# Altium schematic sheet gps.SchDoc
size A4; SheetNumber: 2; SheetTotal: 6
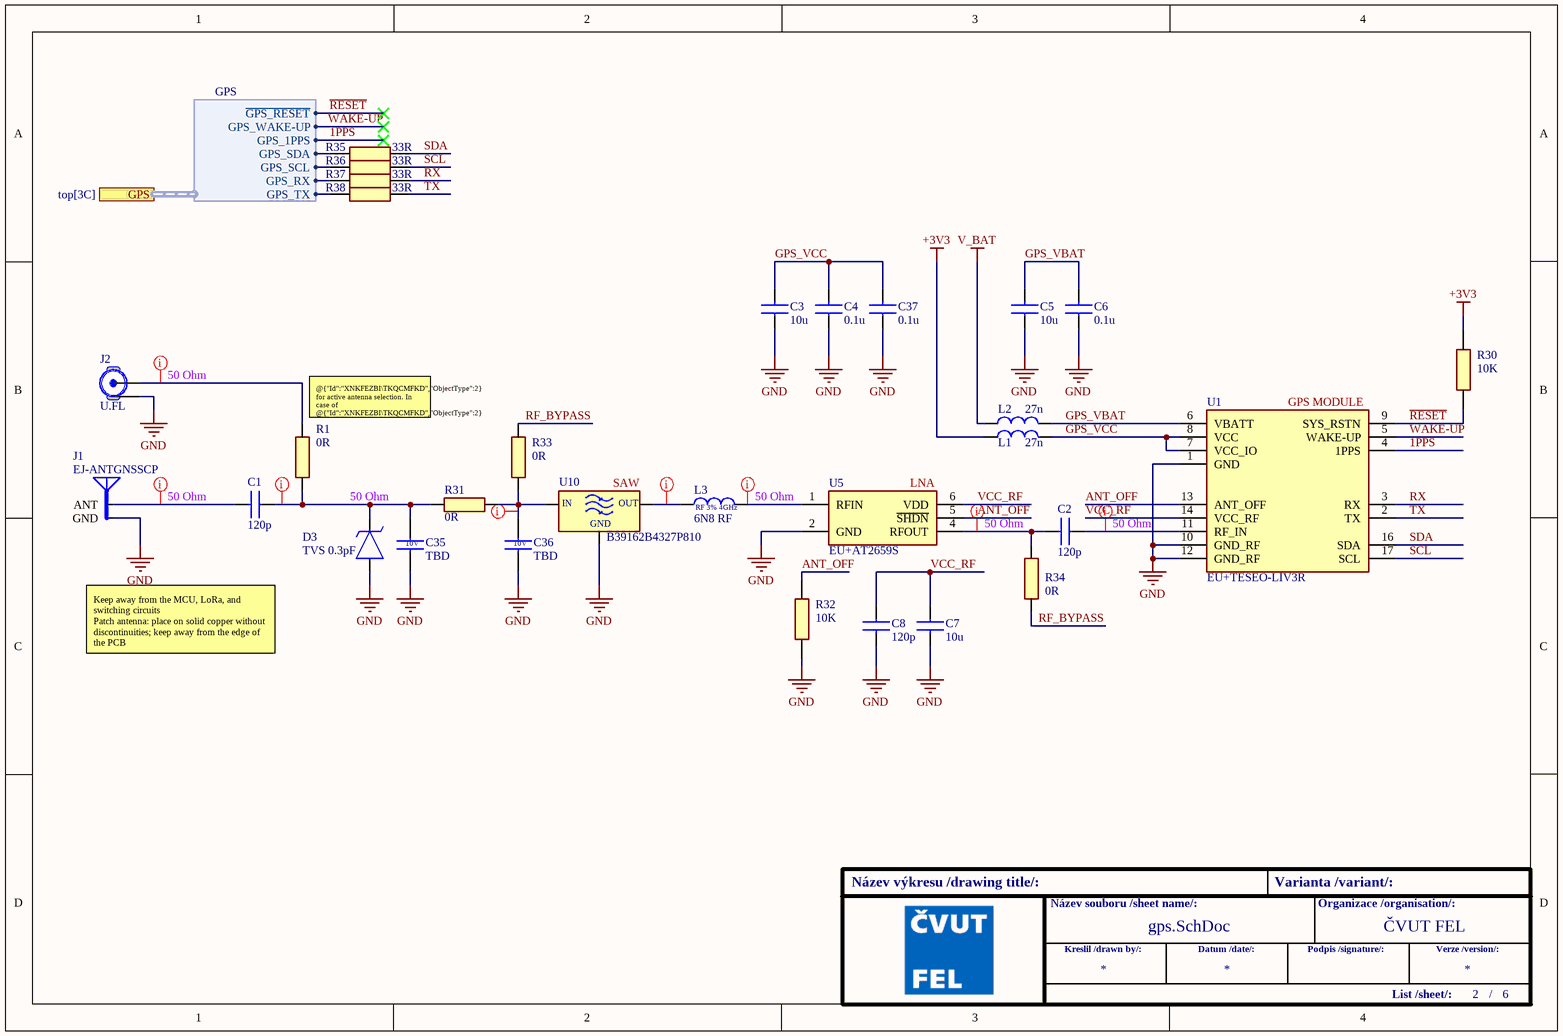
[diagram p0: gps.SchDoc]

## Parts
C1  120p  [CAPC1005X55N]
C2  120p  [CAPC1005X55N]
C3  10u  [C0603]
C4  0.1u  [CAPC1608X95N]
C5  10u  [C0603]
C6  0.1u  [CAPC1608X95N]
C7  10u  [C0603]
C8  120p  [CAPC1005X55N]
C35  TBD  [CAPC1608X97N]
C36  TBD  [CAPC1608X97N]
C37  0.1u  [CAPC1608X95N]
D3  TVS 0.3pF  [SP320501ETG]
J1  EJ-ANTGNSSCP  [ANTGNSSCPTH18L1]
J2  U.FL  [CONUFL001SMDT]
L1  27n  [LQG15WH0N7B02D]
L2  27n  [LQG15WH0N7B02D]
L3  6N8 RF  [LQW15CNR20J00B]
R1  0R  [RESC1005X37N]
R30  10K  [RESC1608X50N]
R31  0R  [RESC1005X37N]
R32  10K  [RESC1608X50N]
R33  0R  [RESC1005X37N]
R34  0R  [RESC1005X37N]
R35  33R  [RESC1608X55N]
R36  33R  [RESC1608X55N]
R37  33R  [RESC1608X55N]
R38  33R  [RESC1608X55N]
U1  EU+TESEO-LIV3R  [TESEOLIV3R]
U5  EU+AT2659S  [SOT95P280X125-6N]
U10  B39162B4327P810  [B39162B4327P810]

## Ports
GPS (harness GPS, see top[3C])

## Harnesses
GPS: GPS_TX, GPS_RX, GPS_SCL, GPS_SDA, GPS_1PPS, GPS_WAKE-UP, ~{GPS_RESET}

## Nets
+3V3: L1.23 R30.2
GND: C3.1 C4.1 C5.1 C6.1 C7.1 C8.1 C35.2 C36.2 C37.1 D3.2(A) J1.2(GND) J2.2(GND) R32.1 U1.1(GND) U1.10(GND_RF) U1.12(GND_RF) U5.2(GND) U10.2
V_BAT: L2.23
1PPS: U1.4(1PPS) ; port GPS.GPS_1PPS
ANT_OFF: R32.2 U1.13(ANT_OFF) U5.5(~{SHDN})
GPS_VBAT: C5.2 C6.2 L2.24 U1.6(VBATT)
GPS_VCC: C3.2 C4.2 C37.2 L1.24 U1.7(VCC_IO) U1.8(VCC)
~{RESET}: R30.1 U1.9(SYS_RSTN) ; port GPS.~{GPS_RESET}
RF_BYPASS: R33.2 R34.1
RX: R37.2 U1.3(RX)
SCL: R36.2 U1.17(SCL)
SDA: R35.2 U1.16(SDA)
TX: R38.2 U1.2(TX)
VCC_RF: C7.2 C8.2 U1.14(VCC_RF) U5.6(VDD)
WAKE-UP: U1.5(WAKE-UP) ; port GPS.GPS_WAKE-UP
NetC1_1: C1.1 J1.1(ANT)
NetC1_2: C1.2 C35.1 D3.1(K) R1.1 R31.1
NetC2_1: C2.1 R34.2 U5.4(RFOUT)
NetC2_2: C2.2 U1.11(RF_IN)
NetC36_1: C36.1 R31.2 R33.1 U10.1(IN)
NetJ2_1: J2.1(SIG) R1.2
NetL3_23: L3.23 U10.4(OUT)
NetL3_24: L3.24 U5.1(RFIN)
NetR35_1: R35.1 ; port GPS.GPS_SDA
NetR36_1: R36.1 ; port GPS.GPS_SCL
NetR37_1: R37.1 ; port GPS.GPS_RX
NetR38_1: R38.1 ; port GPS.GPS_TX

## Layout directives
net class 50R_RF: NetC1_1, NetC1_2, NetC2_1, NetC2_2, NetC36_1, NetJ2_1, NetL3_23, NetL3_24

## Notes on the sheet
- 50 Ohm
- (near R1) @{"Id":"XNKFEZBI\TKQCMFKD","ObjectType":2} for active antenna selection. In case of @{"Id":"XNKFEZBI\TKQCMFKD","ObjectType":2} placed leave @{"Id":"XNKFEZBI\TFZHEKEL","ObjectType":2} unpopulated.
- (near U1) GPS MODULE
- (near U10) SAW
- (near L3) 50 Ohm
- (near U5) LNA
- Keep away from the MCU, LoRa, and switching circuits
  Patch antenna: place on solid copper without discontinuities; keep away from the edge of the PCB
- Název výkresu /drawing title/:
- Název souboru /sheet name/:
- Varianta /variant/:
- Organizace /organisation/:
- ČVUT FEL
- Kreslil /drawn by/:
- Datum /date/:
- Podpis /signature/:
- List /sheet/:
- Verze /version/:
- /
- (in symbol ECK+12p10V) 10V
- (in symbol EL+6N8RF_0402) RF 3% 4GHz
- (in symbol EU+GNSSSAW) GND

## Library data of the parts
C1 C2 C8 = ECK+120p_50V_0402: Multilayer Ceramic Capacitors MLCC - SMD/SMT 120 pF 50 VDC 5% 0402 C0G (NP0) AEC-Q200; Manufacturer_Name: Murata Electronics; Manufacturer_Part_Number: GCM1555C1H121JA16J; Datasheet Link: https://search.murata.co.jp/Ceramy/image/img/A01X/G101/ENG/GCM1555C1H121JA16-01A.pdf; Height: 0.55mm; Mouser Part Number: 81-GCM1555C1H121JA6J; Mouser Price/Stock: https://www.mouser.co.uk/ProductDetail/Murata-Electronics/GCM1555C1H121JA16J?qs=bGEzvQhTDnbTpDR%252B7iTnIA%3D%3D; Arrow Part Number: GCM1555C1H121JA16J; Arrow Price/Stock: https://www.arrow.com/en/products/gcm1555c1h121ja16j/murata-manufacturing?region=nac
C3 C5 C7 = ECK+10u10V: 10 VDC, 20 %, X5R; Manufacturer_Name: KEMET; Manufacturer_Part_Number: C0603C106M8PACTU; Datasheet Link: https://content.kemet.com/datasheets/KEM_C1006_X5R_SMD.pdf; Height: 0.87mm; Mouser Part Number: 80-C0603C106M8PACTU; Mouser Price/Stock: https://www.mouser.co.uk/ProductDetail/KEMET/C0603C106M8PACTU?qs=gt1LBUVyoHk6B7S%252BOYJa0A%3D%3D; Arrow Part Number: C0603C106M8PACTU; Arrow Price/Stock: https://www.arrow.com/en/products/c0603c106m8pactu/kemet-corporation?region=nac
C4 C6 C37 = ECK+100n16V: 16V 0.1uF XR7 0603 10%; Manufacturer_Name: KEMET; Manufacturer_Part_Number: C0603C104K4RAC-TU; Datasheet Link: https://connect.kemet.com:7667/gateway/IntelliData-ComponentDocumentation/1.0/download/specsheet/C0603C104K4RACTU; Height: 0.95mm; Mouser Part Number: 80-C0603C104K4RAC; Arrow Part Number: C0603C104K4RAC-TU; Arrow Price/Stock: https://www.arrow.com/en/products/c0603c104k4ractu/kemet-corporation
C35 C36 = ECK+12p10V: Multilayer Ceramic Capacitors MLCC - SMD/SMT 0603 12pF 10volts C0G(N0P) 1%; Manufacturer_Name: Vishay; Manufacturer_Part_Number: VJ0603A120FXQCW1BC; Datasheet Link: https://www.vishay.com/docs/45199/vjcommercialseries.pdf; Height: 0.97mm; Mouser Part Number: 77-VJ0603A120FXQCBC; Mouser Price/Stock: https://www.mouser.com/Search/Refine.aspx?Keyword=77-VJ0603A120FXQCBC; Arrow Part Number: VJ0603A120FXQCW1BC; Arrow Price/Stock: https://www.arrow.com/en/products/vj0603a120fxqcw1bc/vishay
D3 = ED+TVSSP3205_3V3_0.3pF: ESD Protection Diodes / TVS Diodes ESD 3.3V UNI, Working Voltage: 3.3 V, Clamping Voltage: 12 V, Breakdown Voltage: 3.6 V, Ipp - Peak Pulse Current: 4 A , Cd - Diode Capacitance: 0.3 pF; Manufacturer_Name: LITTELFUSE; Manufacturer_Part_Number: SP3205-01ETG; Datasheet Link: https://4donline.ihs.com/images/VipMasterIC/IC/LFSI/LFSI-S-A0010724013/LFSI-S-A0010724013-1.pdf?hkey=6D3A4C79FDBF58556ACFDE234799DDF0; Height: 0.55mm; Mouser Part Number: 576-SP3205-01ETG; Mouser Price/Stock: https://www.mouser.co.uk/ProductDetail/Littelfuse/SP3205-01ETG?qs=vHuUswq2%252BswfNhVD4WkB%252BQ%3D%3D; Arrow Part Number: SP3205-01ETG; Arrow Price/Stock: https://www.arrow.com/en/products/sp3205-01etg/littelfuse?utm_currency=USD&region=nac
J1 = EJ-ANTGNSSCP: Antennas ANTENNA GNSS L1 18X18 THM; pin to pad: 2>2+3+4+5 2,3,4,5>2+3+4+5; Manufacturer_Name: Linx; Manufacturer_Part_Number: ANT-GNSSCP-TH18L1; Datasheet Link: https://www.te.com/commerce/DocumentDelivery/DDEController?Action=srchrtrv&DocNm=C-ANT-GNSSCP-TH18L1&DocType=Customer%20Drawing&DocLang=English&DocFormat=pdf&PartCntxt=ANT-GNSSCP-TH18L1; Height: 4mm
J2 = EJ+U.FL: RF Connectors / Coaxial Connectors T&R U.FL Straight Surface Mount Jack 6 GHz 50 Ohms; pin to pad: 2>2+3; Manufacturer_Name: TE Connectivity; Manufacturer_Part_Number: CONUFL001-SMD-T; Datasheet Link: https://eu.mouser.com/datasheet/2/418/9/ENG_DS_CONUFL001_SMD_T_B-3238717.pdf; Height: 1.3mm; Mouser Part Number: N/A; Mouser Price/Stock: https://www.mouser.co.uk/ProductDetail/TE-Connectivity/CONUFL001-SMD-T?qs=3Rah4i%252BhyCHmRzMH%252BkLkPQ%3D%3D; Arrow Part Number: CONUFL001-SMD-T; Arrow Price/Stock: https://www.arrow.com/en/products/conufl001-smd-t/te-connectivity?utm_currency=USD&region=nac
L1 L2 = EL+27n_0402: LQG15HS27NJ02D RF Inductors - SMD 27 NH 5%; Datasheet Link: https://cz.mouser.com/datasheet/3/76/2/JELF243B_0010.pdf; Manufacturer_Name: LQG15HS27NJ02D; Manufacturer_Part_Number: LQG15HS27NJ02D; Mouser Part Number: 81-LQG15HS27NJ02D; Mouser Price/Stock: https://mou.sr/4wJB6bA
L3 = EL+6N8RF_0402: RF Inductor
R1 R31 R33 R34 = ER+0R_0402: Thick Film Resistors - SMD 0 Ohms 1/16 W 50 V 1% 0402 - 55 C + 155 C AEC-Q200; Manufacturer_Name: Yageo Group; Manufacturer_Part_Number: AC0402FR-070RL; Datasheet Link: https://www.yageo.com/upload/media/product/productsearch/datasheet/rchip/PYu-AC_51_RoHS_L_11.pdf; Height: 0.37mm; Mouser Part Number: 603-AC0402FR-070RL; Mouser Price/Stock: https://www.mouser.co.uk/ProductDetail/YAGEO/AC0402FR-070RL?qs=ygRr%2FtkhtettkzGxq5kFaA%3D%3D; Arrow Part Number: AC0402FR-070RL; Arrow Price/Stock: https://www.arrow.com/en/products/ac0402fr-070rl/yageo?region=nac
R30 R32 = ER+10K: Resistor 1%, 0.1W; Manufacturer_Name: Vishay; Manufacturer_Part_Number: CRCW060310K0FKEA; Datasheet Link: http://www.vishay.com/docs/20035/dcrcwe3.pdf; Height: 0.5mm; Mouser Part Number: 71-CRCW0603-10K-E3; Mouser Price/Stock: https://www.mouser.co.uk/ProductDetail/Vishay-Dale/CRCW060310K0FKEA?qs=pAO1Z172M84BVnhDjtnsoQ%3D%3D; Arrow Part Number: CRCW060310K0FKEA; Arrow Price/Stock: https://www.arrow.com/en/products/crcw060310k0fkea/vishay?region=europe
R35-R38 = ER+33R: Resistor 0603 1/10W 1%; Manufacturer_Name: ROYALOHM; Manufacturer_Part_Number: 0603WAF330JT5E; Datasheet Link: https://datasheet.lcsc.com/lcsc/2206010116_UNI-ROYAL-Uniroyal-Elec-0603WAF330JT5E_C23140.pdf; Height: 0.55mm; Mouser Part Number: 303-0603WAF330JT5E; Mouser Price/Stock: https://www.mouser.co.uk/ProductDetail/Royalohm/0603WAF330JT5E?qs=e8oIoAS2J1RitKiKgULsBA%3D%3D
U1 = EU+TESEO-LIV3R: Tiny ROM GNSS module; Manufacturer_Name: STMicroelectronics; Datasheet Link: https://www.st.com/resource/en/datasheet/teseo-liv3r.pdf; Height: 2.3mm; Manufacturer_Part_Number: TESEO-LIV3R; Mouser Part Number: 511-TESEO-LIV3R; Mouser Price/Stock: https://www.mouser.co.uk/ProductDetail/STMicroelectronics/TESEO-LIV3R?qs=ZSypp649SOXG7EmhCFcBlw%3D%3D; Arrow Part Number: TESEO-LIV3R; Arrow Price/Stock: https://www.arrow.com/en/products/teseo-liv3r/stmicroelectronics?utm_currency=USD&region=nac
U5 = EU+AT2659S: 1.55GHz~1.615GHz 21.5dB 1.4V~3.6V 0.8dB -14dBm 4.3mA DFN-6(1x1.6) RF Amplifiers RoHS; pin to pad: 2>2+3; Manufacturer_Name: Hangzhou ZhongKe Microelectronics; Datasheet Link: http://lanzhi-tech.com/filedownload/89817; Height: 1.25mm; Manufacturer_Part_Number: AT2659S
U10 = EU+GNSSSAW: Signal Conditioning - 40 C to + 85 C 1.5824 GHz 1 dB 2 MHz, 4.092 MHz, 8.34 MHz 50 Ohms GNSS; pin to pad: 2>2+3+5; Manufacturer_Name: RF360; Datasheet Link: https://mm.digikey.com/Volume0/opasdata/d220001/medias/docus/992/B39162B4327P810_Rev2.2.pdf; Height: 0.45mm; Manufacturer_Part_Number: B39162B4327P810; Mouser Part Number: 871-B39162B4327P810; Mouser Price/Stock: https://www.mouser.co.uk/ProductDetail/RF360/B39162B4327P810?qs=lGUynpphgXxwtn5A8O%2FIyg%3D%3D; Arrow Part Number: B39162B4327P810; Arrow Price/Stock: https://www.arrow.com/en/products/b39162b4327p810/qualcomm-rf360-a-qualcomm-tdk-joint-venture?region=nac